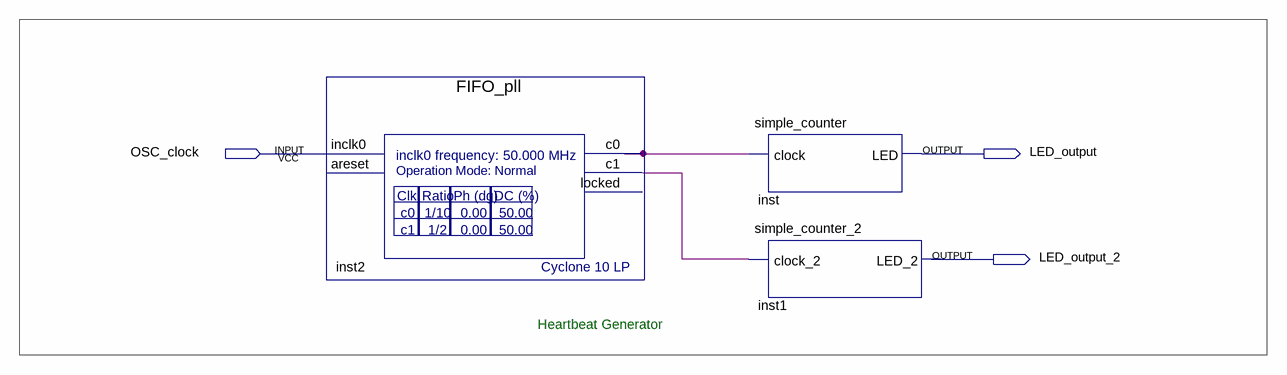
[diagram p0: schematic sheet]
// Quartus schematic FIFO_TOP.bdf as structural Verilog: 3 symbols, 3 pins
module FIFO_TOP (
  input  OSC_clock,
  output LED_output,
  output LED_output_2
);

  wire inst2_c0, inst2_c1;

  FIFO_pll inst2 (.inclk0(OSC_clock), .c0(inst2_c0), .c1(inst2_c1));  // open: areset, locked
  simple_counter inst (.clock(inst2_c0), .LED(LED_output));
  simple_counter_2 inst1 (.clock_2(inst2_c1), .LED_2(LED_output_2));

  // Notes on the sheet:
  //   Heartbeat Generator
endmodule
